# EAGLE design DigPSU (EAGLE 5.07)
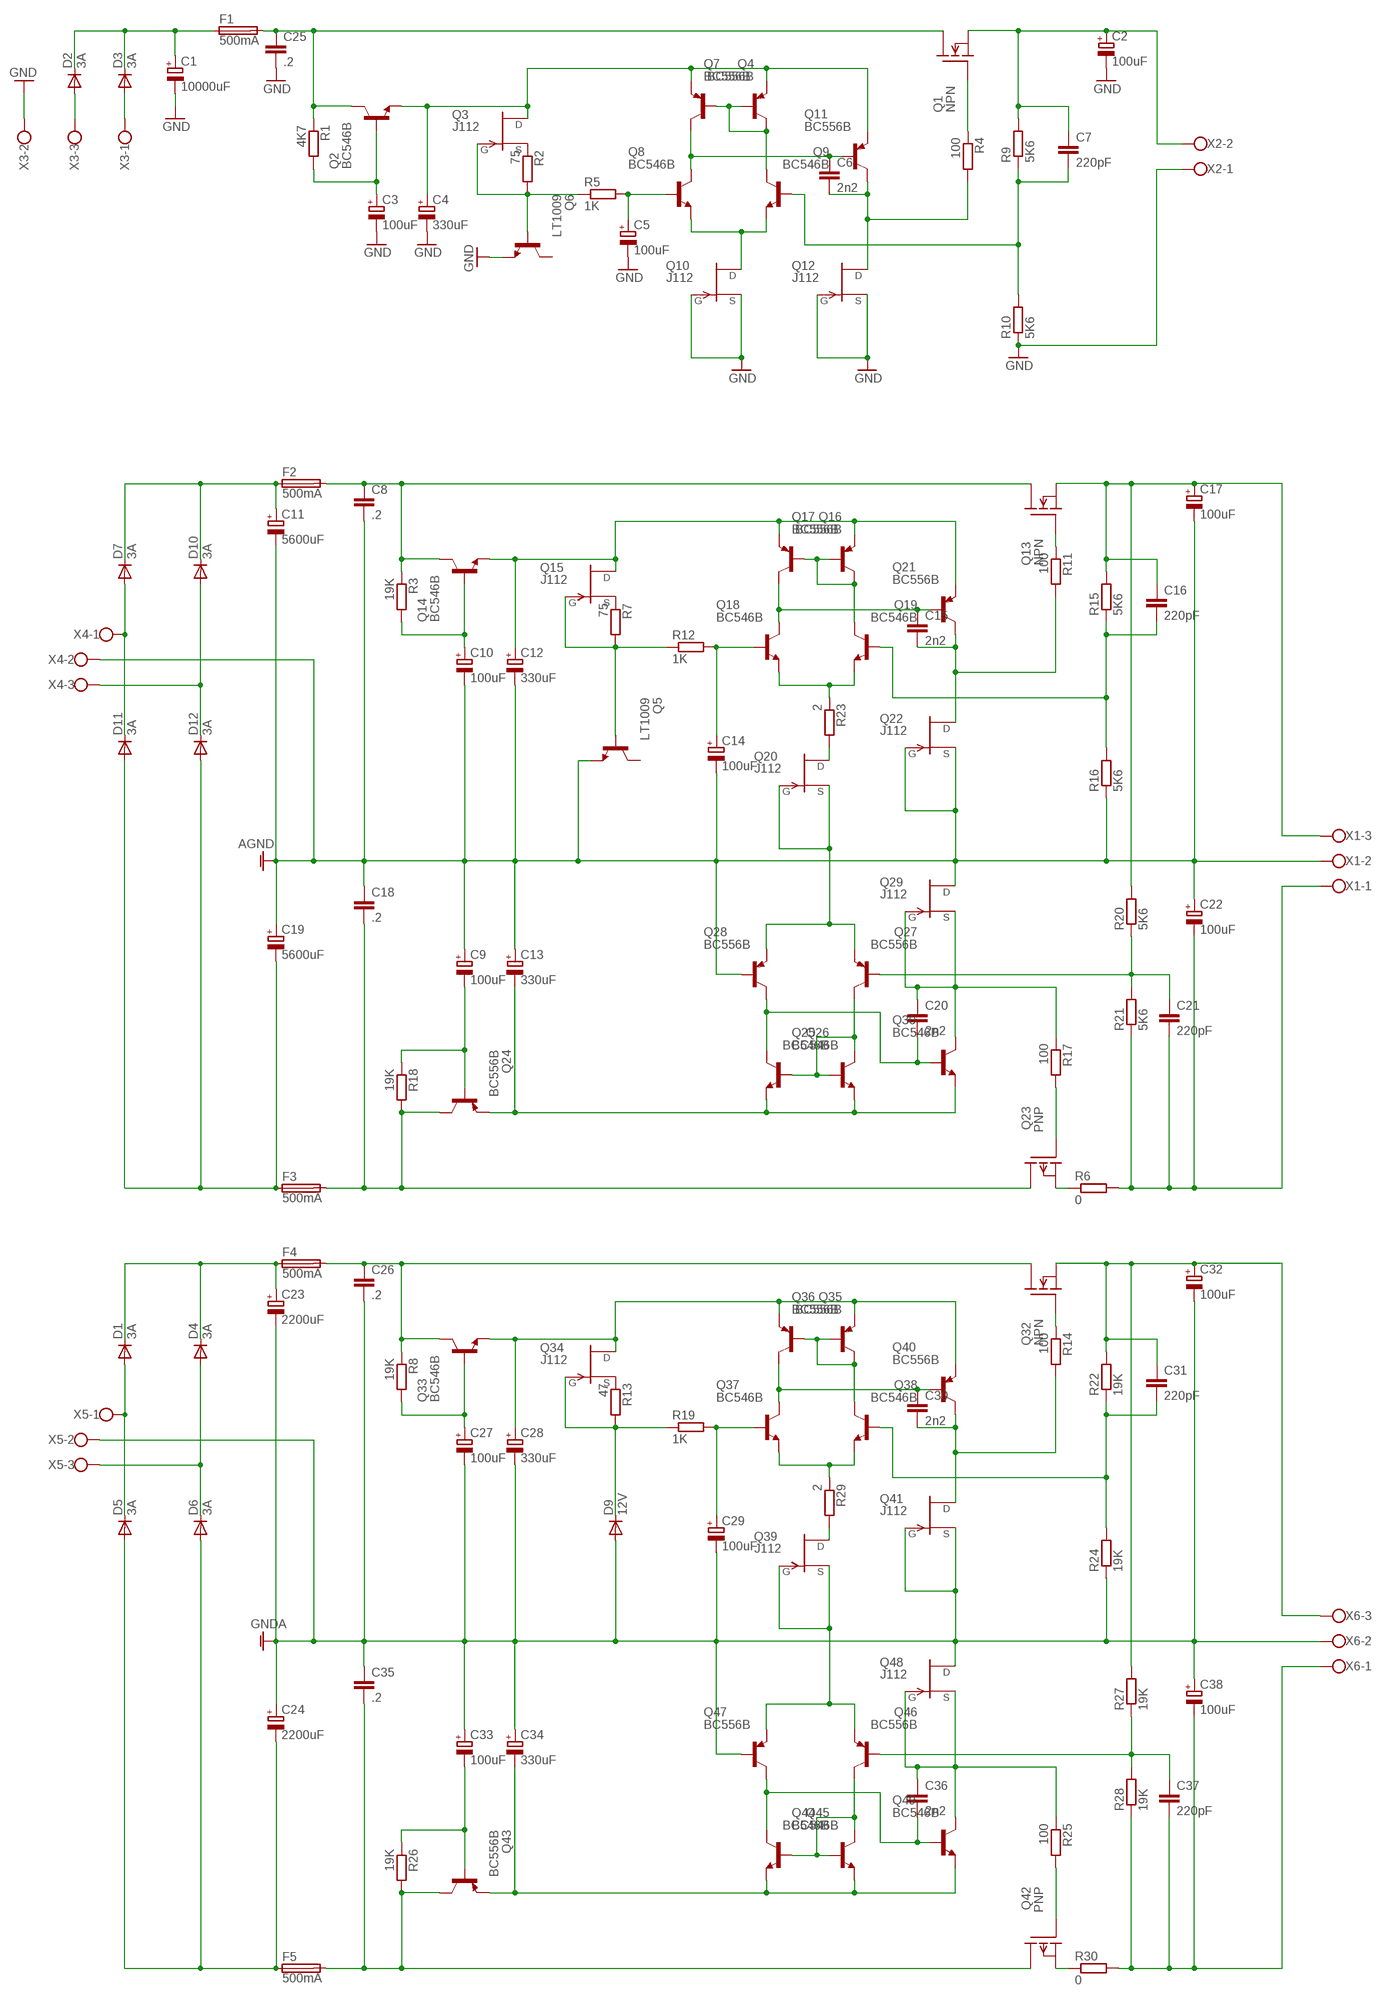
[diagram p0: schematic, sheet 1]

## Parts
C1  10000uF  CPOL-EUE7.5-16  [E7,5-16]
C2  100uF  CPOL-EUE5-10.5  [E5-10,5]
C3  100uF  CPOL-EUE3.5-8  [E3,5-8]
C4  330uF  CPOL-EUE3.5-10  [E3,5-10]
C5  100uF  CPOL-EUE3.5-8  [E3,5-8]
C6  2n2  C-EU050-045X075  [C050-045X075]
C7  220pF  C-EU050-045X075  [C050-045X075]
C8  .2  C-EUC1210K  [C1210K]
C9  100uF  CPOL-EUE3.5-8  [E3,5-8]
C10  100uF  CPOL-EUE3.5-8  [E3,5-8]
C11  5600uF  CPOL-EUE7.5-16  [E7,5-16]
C12  330uF  CPOL-EUE3.5-10  [E3,5-10]
C13  330uF  CPOL-EUE3.5-10  [E3,5-10]
C14  100uF  CPOL-EUE3.5-8  [E3,5-8]
C15  2n2  C-EU050-045X075  [C050-045X075]
C16  220pF  C-EU050-045X075  [C050-045X075]
C17  100uF  CPOL-EUE5-10.5  [E5-10,5]
C18  .2  C-EUC1210K  [C1210K]
C19  5600uF  CPOL-EUE7.5-16  [E7,5-16]
C20  2n2  C-EU050-045X075  [C050-045X075]
C21  220pF  C-EU050-045X075  [C050-045X075]
C22  100uF  CPOL-EUE5-10.5  [E5-10,5]
C23  2200uF  CPOL-EUE7.5-16  [E7,5-16]
C24  2200uF  CPOL-EUE7.5-16  [E7,5-16]
C25  .2  C-EUC1210K  [C1210K]
C26  .2  C-EUC1210K  [C1210K]
C27  100uF  CPOL-EUE3.5-8  [E3,5-8]
C28  330uF  CPOL-EUE3.5-10  [E3,5-10]
C29  100uF  CPOL-EUE3.5-8  [E3,5-8]
C30  2n2  C-EU050-045X075  [C050-045X075]
C31  220pF  C-EU050-045X075  [C050-045X075]
C32  100uF  CPOL-EUE5-10.5  [E5-10,5]
C33  100uF  CPOL-EUE3.5-8  [E3,5-8]
C34  330uF  CPOL-EUE3.5-10  [E3,5-10]
C35  .2  C-EUC1210K  [C1210K]
C36  2n2  C-EU050-045X075  [C050-045X075]
C37  220pF  C-EU050-045X075  [C050-045X075]
C38  100uF  CPOL-EUE5-10.5  [E5-10,5]
D1  3A  A114  [DO204-10]
D2  3A  A114  [DO204-10]
D3  3A  A114  [DO204-10]
D4  3A  A114  [DO204-10]
D5  3A  A114  [DO204-10]
D6  3A  A114  [DO204-10]
D7  3A  A114  [DO204-10]
D9  12V  1N4148DO35-7  [DO35-7]
D10  3A  A114  [DO204-10]
D11  3A  A114  [DO204-10]
D12  3A  A114  [DO204-10]
F1  500mA  19560  [19560]
F2  500mA  19560  [19560]
F3  500mA  19560  [19560]
F4  500mA  19560  [19560]
F5  500mA  19560  [19560]
Q1  NPN  BUZ21  [TO220]
Q2  BC546B  BC550B  [TO92-EBC]
Q3  J112  2N5484  [TO92-]
Q4  BC556B  BC560  [TO92-EBC]
Q5  LT1009  BC546A  [TO92-EBC]
Q6  LT1009  BC546A  [TO92-EBC]
Q7  BC556B  BC560  [TO92-EBC]
Q8  BC546B  BC550B  [TO92-EBC]
Q9  BC546B  BC550B  [TO92-EBC]
Q10  J112  2N5484  [TO92-]
Q11  BC556B  BC560  [TO92-EBC]
Q12  J112  2N5484  [TO92-]
Q13  NPN  BUZ21  [TO220]
Q14  BC546B  BC550B  [TO92-EBC]
Q15  J112  2N5484  [TO92-]
Q16  BC556B  BC560  [TO92-EBC]
Q17  BC556B  BC560  [TO92-EBC]
Q18  BC546B  BC550B  [TO92-EBC]
Q19  BC546B  BC550B  [TO92-EBC]
Q20  J112  2N5484  [TO92-]
Q21  BC556B  BC560  [TO92-EBC]
Q22  J112  2N5484  [TO92-]
Q23  PNP  BUZ171  [TO220]
Q24  BC556B  BC560  [TO92-EBC]
Q25  BC546B  BC550B  [TO92-EBC]
Q26  BC546B  BC550B  [TO92-EBC]
Q27  BC556B  BC560  [TO92-EBC]
Q28  BC556B  BC560  [TO92-EBC]
Q29  J112  2N5484  [TO92-]
Q30  BC546B  BC550B  [TO92-EBC]
Q32  NPN  BUZ21  [TO220]
Q33  BC546B  BC550B  [TO92-EBC]
Q34  J112  2N5484  [TO92-]
Q35  BC556B  BC560  [TO92-EBC]
Q36  BC556B  BC560  [TO92-EBC]
Q37  BC546B  BC550B  [TO92-EBC]
Q38  BC546B  BC550B  [TO92-EBC]
Q39  J112  2N5484  [TO92-]
Q40  BC556B  BC560  [TO92-EBC]
Q41  J112  2N5484  [TO92-]
Q42  PNP  BUZ171  [TO220]
Q43  BC556B  BC560  [TO92-EBC]
Q44  BC546B  BC550B  [TO92-EBC]
Q45  BC546B  BC550B  [TO92-EBC]
Q46  BC556B  BC560  [TO92-EBC]
Q47  BC556B  BC560  [TO92-EBC]
Q48  J112  2N5484  [TO92-]
Q49  BC546B  BC550B  [TO92-EBC]
R1  4K7  R-EU_0204/7  [0204/7]
R2  75  R-EU_0204/7  [0204/7]
R3  19K  R-EU_0204/7  [0204/7]
R4  100  R-EU_0207/10  [0207/10]
R5  1K  R-EU_0204/7  [0204/7]
R6  0  R-EU_0204/7  [0204/7]
R7  75  R-EU_0204/7  [0204/7]
R8  19K  R-EU_0204/7  [0204/7]
R9  5K6  R-EU_0204/7  [0204/7]
R10  5K6  R-EU_0204/7  [0204/7]
R11  100  R-EU_0207/10  [0207/10]
R12  1K  R-EU_0204/7  [0204/7]
R13  47  R-EU_0204/7  [0204/7]
R14  100  R-EU_0207/10  [0207/10]
R15  5K6  R-EU_0204/7  [0204/7]
R16  5K6  R-EU_0204/7  [0204/7]
R17  100  R-EU_0207/10  [0207/10]
R18  19K  R-EU_0204/7  [0204/7]
R19  1K  R-EU_0204/7  [0204/7]
R20  5K6  R-EU_0204/7  [0204/7]
R21  5K6  R-EU_0204/7  [0204/7]
R22  19K  R-EU_0204/7  [0204/7]
R23  2  R-EU_0204/7  [0204/7]
R24  19K  R-EU_0204/7  [0204/7]
R25  100  R-EU_0207/10  [0207/10]
R26  19K  R-EU_0204/7  [0204/7]
R27  19K  R-EU_0204/7  [0204/7]
R28  19K  R-EU_0204/7  [0204/7]
R29  2  R-EU_0204/7  [0204/7]
R30  0  R-EU_0204/7  [0204/7]
X1  W237-3E  [W237-3E]
X2  W237-02P  [W237-132]
X3  W237-3E  [W237-3E]
X4  W237-3E  [W237-3E]
X5  W237-3E  [W237-3E]
X6  W237-3E  [W237-3E]

## Nets
AGND: C8.2 C9.+ C10.- C11.- C12.- C13.+ C14.- C17.- C18.1 C19.+ C22.+ Q5.E Q22.1(G) Q22.2(S) Q28.B Q29.3(D) R16.1 X1.2 X4.2
GND: C1.- C2.- C3.- C4.- C5.- C25.2 Q6.E Q10.1(G) Q10.2(S) Q12.1(G) Q12.2(S) R10.1 X2.1 X3.2
GNDA: C23.- C24.+ C26.2 C27.- C28.- C29.- C32.- C33.+ C34.+ C35.1 C38.+ D9.A Q41.1(G) Q41.2(S) Q47.B Q48.3(D) R24.1 X5.2 X6.2
N$1: C25.1 F1.2 Q1.2(D) Q2.C R1.1
N$2: C2.+ C7.1 Q1.3(S) R9.2 X2.2
N$3: Q1.1(G) R4.1
N$4: C3.+ Q2.B R1.2
N$5: C4.+ Q2.E Q3.3(D) Q4.E Q7.E Q11.E
N$6: Q3.1(G) Q6.B R2.2 R5.1
N$7: D2.A X3.3
N$8: Q3.2(S) R2.1
N$9: C5.+ Q8.B R5.2
N$10: Q4.B Q7.B Q7.C Q9.C
N$11: Q23.1(G) R17.2
N$12: C1.+ D2.C D3.C F1.1
N$13: Q8.E Q9.E Q10.3(D)
N$14: C6.1 Q4.C Q8.C Q11.B
N$15: D3.A X3.1
N$16: Q23.3(S) R6.1
N$17: C8.1 F2.2 Q13.2(D) Q14.C R3.1
N$18: C6.2 Q11.C Q12.3(D) R4.2
N$19: C23.+ D1.C D4.C F4.1
N$20: C24.- D5.A D6.A F5.1
N$21: C7.2 Q9.B R9.1 R10.2
N$22: C10.+ Q14.B R3.2
N$23: D10.A D12.C X4.3
N$24: C12.+ Q14.E Q15.3(D) Q16.E Q17.E Q21.E
N$26: Q5.B Q15.1(G) R7.2 R12.1
N$27: Q15.2(S) R7.1
N$28: Q13.1(G) R11.1
N$29: D7.A D11.C X4.1
N$30: C11.+ D7.C D10.C F2.1
N$31: C14.+ Q18.B R12.2
N$32: Q16.B Q17.B Q17.C Q19.C
N$33: Q18.E Q19.E R23.1
N$34: C35.2 F5.2 Q42.2(D) Q43.C R26.2
N$35: C15.1 Q16.C Q18.C Q21.B
N$36: C15.2 Q21.C Q22.3(D) R11.2
N$37: C26.1 F4.2 Q32.2(D) Q33.C R8.1
N$38: C16.2 Q19.B R15.1 R16.2
N$39: C9.- Q24.B R18.1
N$40: C13.- Q24.E Q25.E Q26.E Q30.E
N$41: Q20.3(D) R23.2
N$43: Q25.B Q25.C Q26.B Q27.C
N$44: C18.2 F3.2 Q23.2(D) Q24.C R18.2
N$45: C21.2 C22.- R6.2 R21.1 X1.1
N$46: C19.- D11.A D12.A F3.1
N$47: C20.2 Q26.C Q28.C Q30.B
N$49: C20.1 Q29.1(G) Q29.2(S) Q30.C R17.1
N$50: D4.A D6.C X5.3
N$51: C21.1 Q27.B R20.1 R21.2
N$52: Q20.1(G) Q20.2(S) Q27.E Q28.E
N$53: C16.1 C17.+ Q13.3(S) R15.2 R20.2 X1.3
N$54: D1.A D5.C X5.1
N$55: C27.+ Q33.B R8.2
N$56: C28.+ Q33.E Q34.3(D) Q35.E Q36.E Q40.E
N$57: D9.C Q34.1(G) R13.2 R19.1
N$58: Q34.2(S) R13.1
N$59: Q32.1(G) R14.1
N$60: C29.+ Q37.B R19.2
N$61: Q35.B Q36.B Q36.C Q38.C
N$62: Q37.E Q38.E R29.1
N$63: C30.1 Q35.C Q37.C Q40.B
N$64: C30.2 Q40.C Q41.3(D) R14.2
N$65: C31.2 Q38.B R22.1 R24.2
N$66: Q42.1(G) R25.2
N$67: C33.- Q43.B R26.1
N$68: C34.- Q43.E Q44.E Q45.E Q49.E
N$69: Q44.B Q44.C Q45.B Q46.C
N$70: C36.2 Q45.C Q47.C Q49.B
N$71: C36.1 Q48.1(G) Q48.2(S) Q49.C R25.1
N$72: C37.2 C38.- R28.1 R30.2 X6.1
N$73: C37.1 Q46.B R27.1 R28.2
N$74: Q39.1(G) Q39.2(S) Q46.E Q47.E
N$75: Q39.3(D) R29.2
N$76: C31.1 C32.+ Q32.3(S) R22.2 R27.2 X6.3
N$77: Q42.3(S) R30.1
Unconnected: Q5.C Q6.C

## Library data of the parts
C1-C5 C9-C14 C17 C19 C22-C24 C27-C29 C32-C34 C38 = resistor:CPOL-EU: POLARIZED CAPACITOR, European symbol
C6-C8 C15 C16 C18 C20 C21 C25 C26 C30 C31 C35-C37 = resistor:C-EU: CAPACITOR, European symbol
D1-D7 D10-D12 = diode:A114: DIODE germanium
D9 = diode:1N4148: DIODE high speed (Philips)
F1-F5 = fuse:19560: FUSE HOLDER TR5, Wickmann
Q1 Q13 Q32 = transistor-fet:BUZ21: N-Channel Enhancement MOSFET 100V; 19A; 0,1Ohm
Q2 Q8 Q9 Q14 Q18 Q19 Q25 Q26 Q30 Q33 Q37 Q38 Q44 Q45 Q49 = transistor-npn:BC550*: NPN Transistor
Q3 Q10 Q12 Q15 Q20 Q22 Q29 Q34 Q39 Q41 Q48 = transistor-fet:?548*: N-Channel JFETs Source: VISHAY 2N5484.pdf Compatible: TO92 2N5245 J304 J305 U310 J308 J309 J310 TO72 2N4416 2N4416A 2N3823 2N4351 3N169 3N170 3N171 MFE3002 TO18 2N3796 2N3797 MFE825 Source: Motorola European Master Guide Pacge 3-59
Q4 Q7 Q11 Q16 Q17 Q21 Q24 Q27 Q28 Q35 Q36 Q40 Q43 Q46 Q47 = transistor-pnp:BC560*: PNP Transistror
Q5 Q6 = transistor-npn:BC546*: NPN Transistor
Q23 Q42 = transistor-fet:BUZ171: P-Channel Enhancement MOSFET -50V; 7A; 0,4Ohm
R1-R30 = resistor:R-EU_: RESISTOR, European symbol
X1 X3-X6 = con-wago-508:W237-3E: WAGO SREW CLAMP
X2 = con-wago-508:W237-02P: WAGO SREW CLAMP

## Board
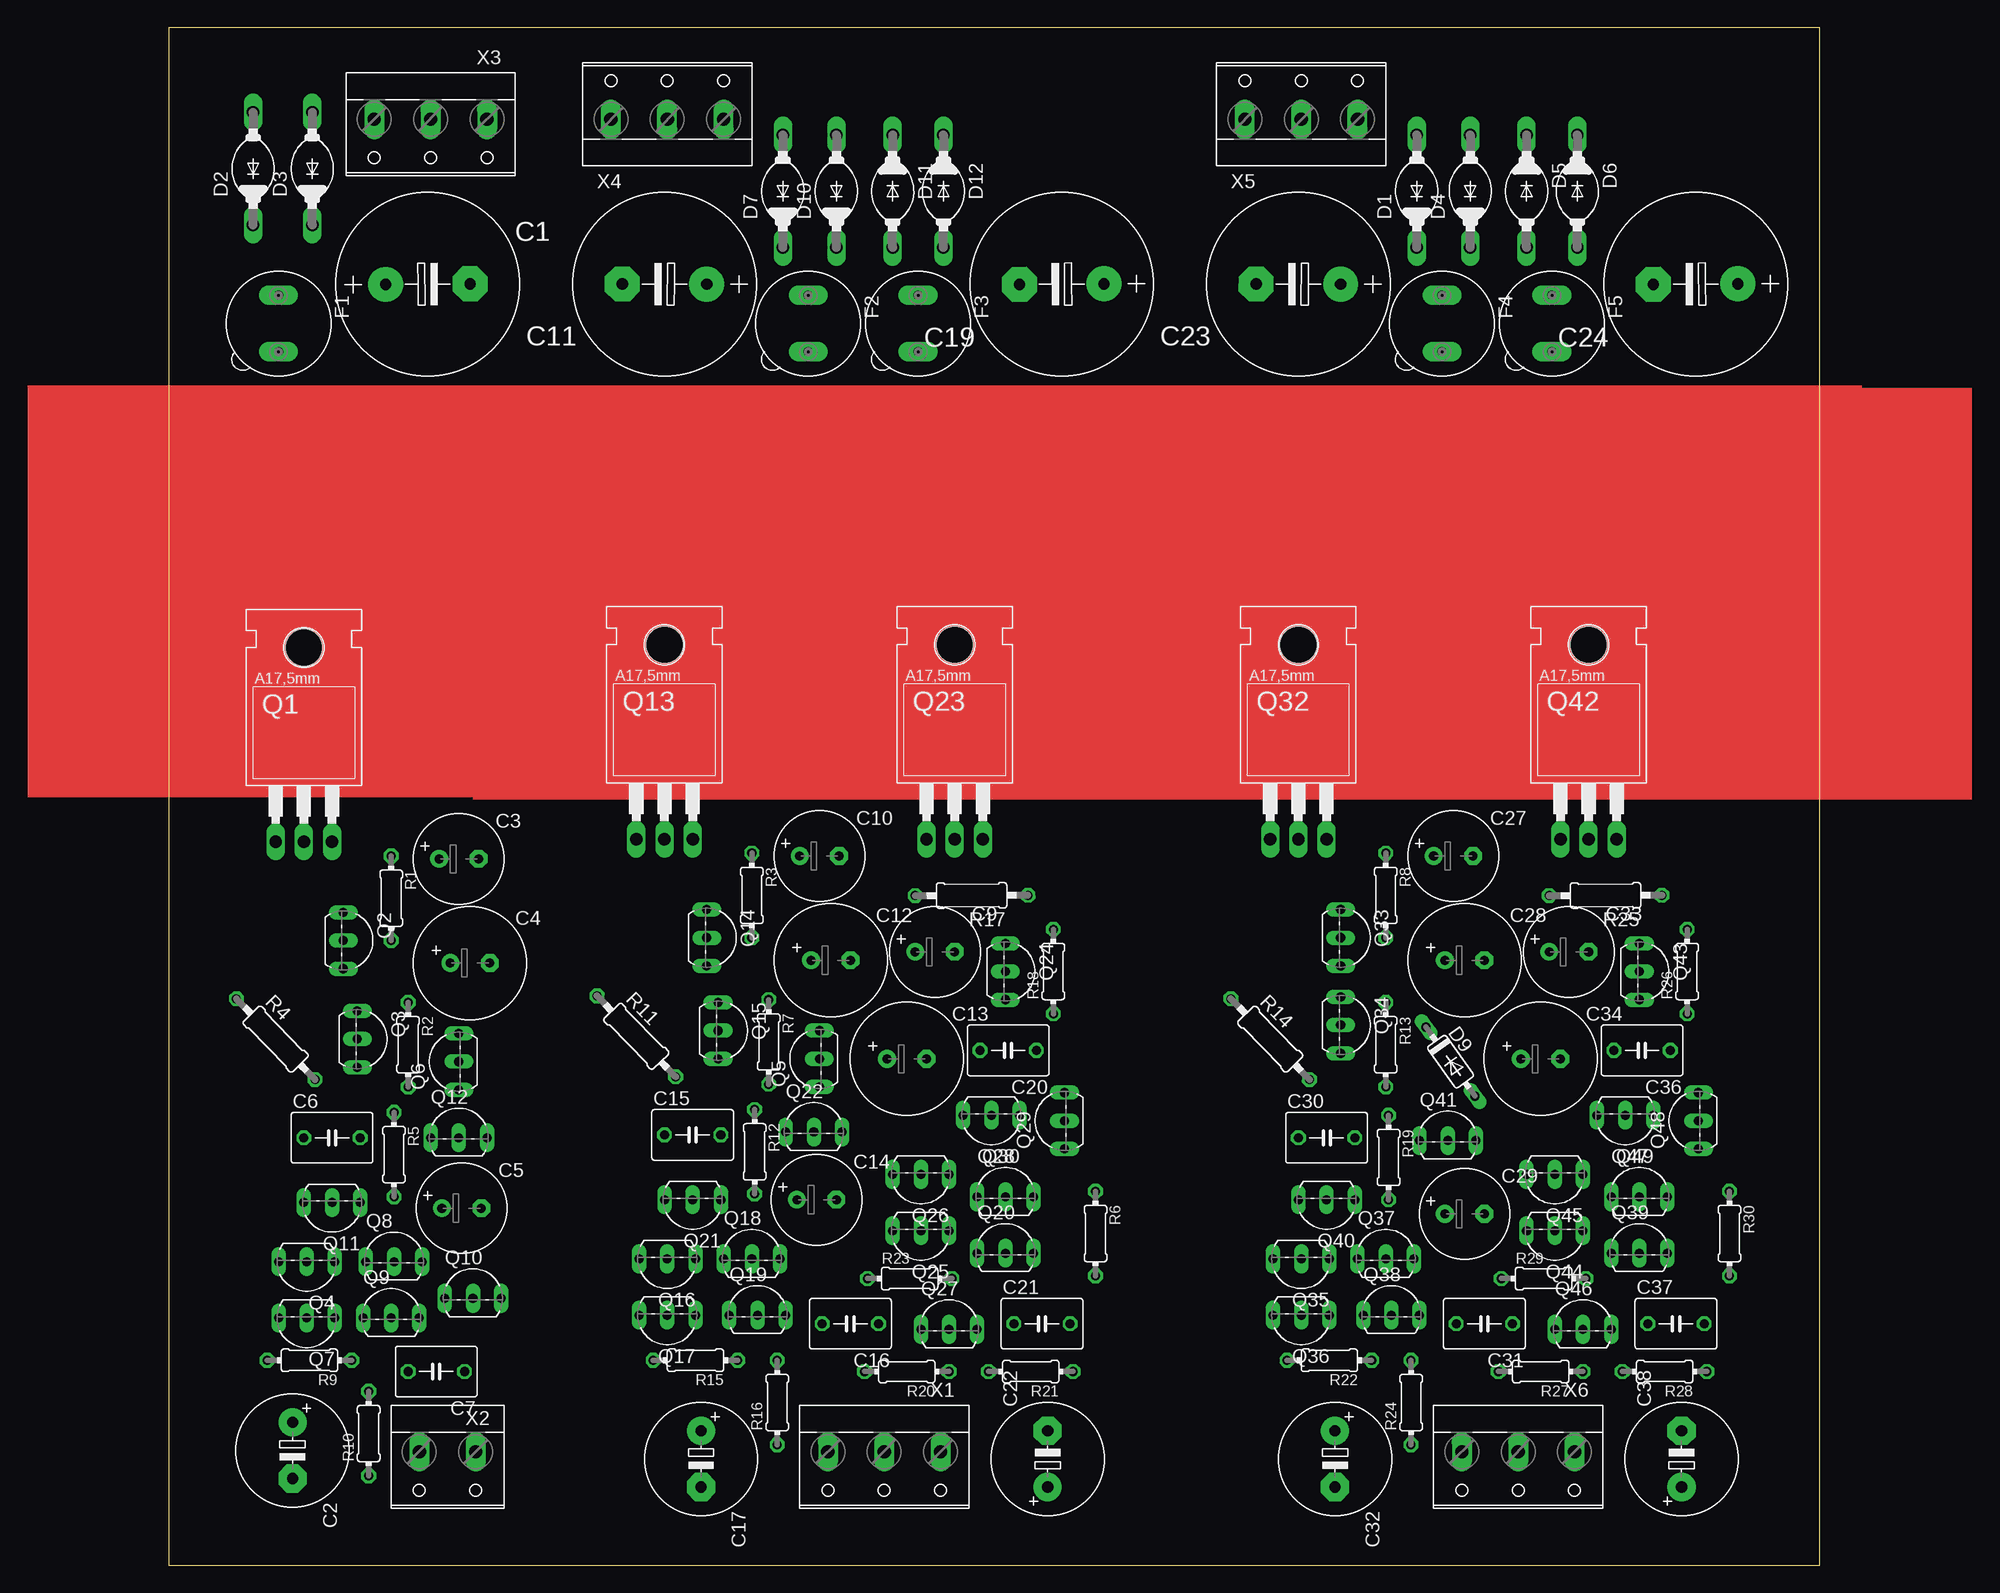
[diagram p1: board, top side]
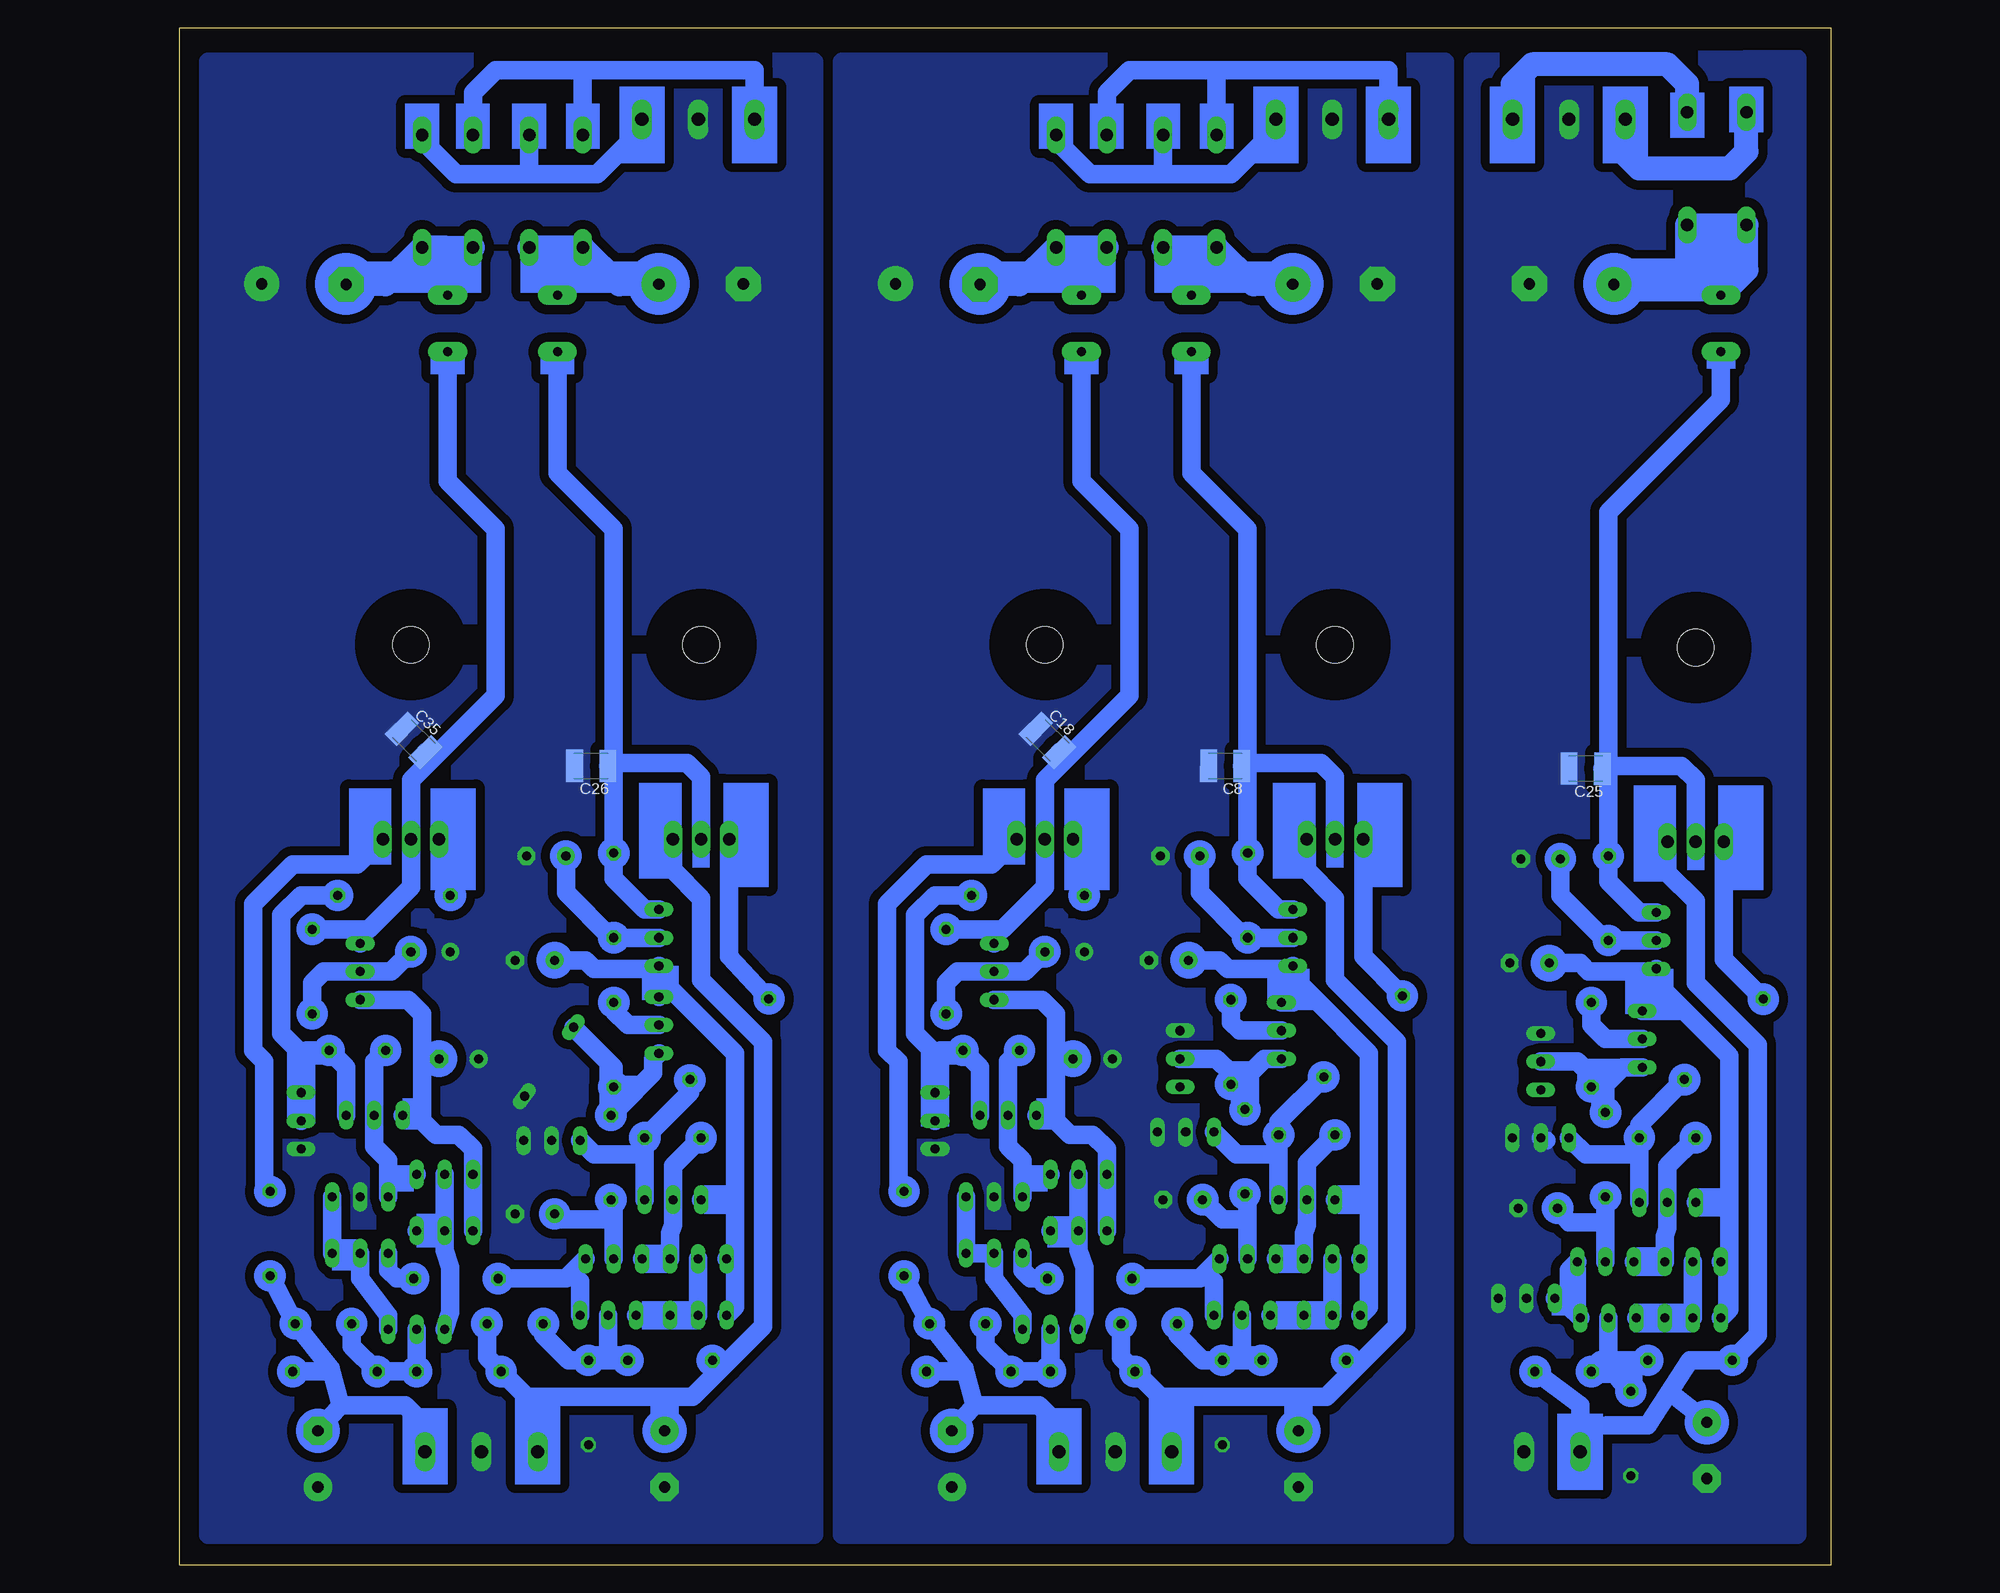
[diagram p2: board, bottom side, seen from below]

Size 148.82 x 138.61 mm. Coordinates in mm from the lower left corner, seen from the top.
Outline: 148.82,138.61 0,138.61 0,0 148.82,0 148.82,138.61
Copper layers (1*16): Top 0.035mm / dielectric 1.5mm / Bottom 0.035mm
Design rules "default *": minimum track width 10mil, minimum drill 24mil, track to track 8mil, track to pad 8mil, pad to pad 8mil, via to via 8mil, smd to smd 8mil, copper to edge 40mil, drill to drill 8mil, minimum pad ring 10mil, minimum via ring 8mil, stop-mask expansion 4mil, vias tented up to drill 0mil, thermal gap 10mil

### Footprints (pad centres in the part's own frame; a part is rotated, then mirrored left to right if it is on the bottom)
E7,5-16 = drill 1.016 pad 3.15 round: + -3.81,0 | drill 1.016 pad 3.15 octagon: - 3.81,0
E5-10,5 = drill 1.016 pad 2.54 round: + -2.54,0 | drill 1.016 pad 2.54 octagon: - 2.54,0
E3,5-8 = drill 0.813 pad 1.6 round: + -1.778,0 | drill 0.813 pad 1.6 octagon: - 1.778,0
E3,5-10 = drill 0.813 pad 1.6 round: + -1.778,0 | drill 0.813 pad 1.6 octagon: - 1.778,0
C050-045X075 = drill 0.813 octagon: 1 -2.54,0; 2 2.54,0
C1210K = smd 1.5 x 2.9: 1 -1.5,0; 2 1.5,0
DO204-10 = drill 1.118 long: A 5.08,0; C -5.08,0
DO35-7 = drill 0.813 long: A 3.81,0; C -3.81,0
19560 = drill 0.813 pad 1.778 long: 1 -2.54,0; 2 2.54,0
TO220 = drill 1.118 long: 1 -2.54,-6.35; 2 0,-6.35; 3 2.54,-6.35 | hole 3.302: 0,11.176
TO92-EBC = drill 0.813 long: B 0,-1.27; C -2.54,-1.27; E 2.54,-1.27
TO92- = drill 0.813 long: 1 2.54,0; 2 0,0; 3 -2.54,0
0204/7 = drill 0.813 octagon: 1 -3.81,0; 2 3.81,0
0207/10 = drill 0.813 octagon: 1 -5.08,0; 2 5.08,0
W237-3E = drill 1.194 long: 1 -5.08,-0.635; 2 0,-0.635; 3 5.08,-0.635
W237-132 = drill 1.194 long: 1 -2.54,-0.635; 2 2.54,-0.635

### Placement (x,y rotation side)
C1  23.35,115.49 0.4 top
C2  11.16,10.34 270 top
C3  26.14,63.68 0 top
C4  27.16,54.28 0 top
C5  26.4,32.18 0 top
C6  14.71,38.53 0 top
C7  24.11,17.45 180 top
C8  54.59,72.06 179.9 bottom
C9  69.07,55.3 0 top
C10  58.65,63.93 0 top
C11  44.68,115.49 179.8 top
C12  59.67,54.53 0 top
C13  66.53,45.64 0 top
C14  58.4,32.94 0 top
C15  47.22,38.79 0 top
C16  61.45,21.77 180 top
C17  47.99,9.58 270 top
C18  70.59,74.35 315 bottom
C19  80.5,115.49 180.4 top
C20  75.67,46.41 180 top
C21  78.72,21.77 0 top
C22  79.23,9.58 90 top
C23  101.83,115.49 179.8 top
C24  137.65,115.49 180.4 top
C25  22.08,71.81 179.9 bottom
C26  111.74,72.06 179.9 bottom
C27  115.8,63.93 0 top
C28  116.82,54.53 0 top
C29  116.82,31.67 0 top
C30  104.37,38.53 0 top
C31  118.6,21.77 180 top
C32  105.14,9.58 270 top
C33  126.22,55.3 0 top
C34  123.68,45.64 0 top
C35  127.74,74.35 315 bottom
C36  132.82,46.41 180 top
C37  135.87,21.77 0 top
C38  136.38,9.58 90 top
D1  112.5,123.88 90 top
D2  7.6,125.91 90 top
D3  12.93,125.91 90 top
D4  117.33,123.88 90 top
D5  122.41,123.88 270 top
D6  126.98,123.88 270 top
D7  55.35,123.88 90 top
D9  115.55,45.39 305.3 top
D10  60.18,123.88 90 top
D11  65.26,123.88 270 top
D12  69.83,123.88 270 top
F1  9.89,111.94 270 top
F2  57.64,111.94 270 top
F3  67.54,111.94 270 top
F4  114.79,111.94 270 top
F5  124.69,111.94 270 top
Q1  12.17,71.55 0 top
Q2  17,56.31 270 top
Q3  17,47.42 270 top
Q4  12.43,26.09 180 top
Q5  57.38,45.64 90 top
Q6  24.87,45.39 90 top
Q7  12.43,21.01 180 top
Q8  20.3,28.63 0 top
Q9  20.05,23.55 0 top
Q10  27.41,24.05 0 top
Q11  14.71,31.42 180 top
Q12  26.14,38.53 0 top
Q13  44.68,71.81 0 top
Q14  49.76,56.57 270 top
Q15  49.51,48.18 270 top
Q16  44.94,26.34 180 top
Q17  44.94,21.26 180 top
Q18  52.56,28.88 0 top
Q19  53.07,23.8 0 top
Q20  75.42,28.12 0 top
Q21  47.22,31.67 180 top
Q22  58.15,39.04 0 top
Q23  70.85,71.81 0 top
Q24  76.69,53.52 270 top
Q25  67.8,28.88 180 top
Q26  67.8,33.96 180 top
Q27  70.34,22.53 0 top
Q28  75.42,34.47 0 top
Q29  80.75,40.06 90 top
Q30  74.15,39.29 180 top
Q32  101.83,71.81 0 top
Q33  106.91,56.57 270 top
Q34  105.64,48.69 270 top
Q35  102.09,26.34 180 top
Q36  102.09,21.26 180 top
Q37  109.71,28.88 0 top
Q38  110.22,23.8 0 top
Q39  132.57,28.12 0 top
Q40  104.37,31.67 180 top
Q41  115.3,38.28 0 top
Q42  128,71.81 0 top
Q43  133.84,53.52 270 top
Q44  124.95,28.88 180 top
Q45  124.95,33.96 180 top
Q46  127.49,22.53 0 top
Q47  132.57,34.47 0 top
Q48  137.9,40.06 90 top
Q49  131.3,39.29 180 top
R1  20.05,60.12 270 top
R2  21.57,46.91 270 top
R3  52.56,60.38 270 top
R4  9.63,47.42 314.2 top
R5  20.3,37.01 270 top
R6  83.55,29.9 270 top
R7  54.08,47.17 270 top
R8  109.71,60.38 270 top
R9  12.68,18.47 180 top
R10  18.01,11.86 90 top
R11  42.14,47.68 314.2 top
R12  52.81,37.26 270 top
R13  109.71,46.91 270 top
R14  99.29,47.42 314.2 top
R15  47.48,18.47 180 top
R16  54.84,14.66 90 top
R17  72.37,60.38 180.2 top
R18  79.74,53.52 90 top
R19  109.96,36.75 270 top
R20  66.53,17.45 180 top
R21  77.7,17.45 180 top
R22  104.63,18.47 180 top
R23  66.78,25.83 0 top
R24  111.99,14.66 90 top
R25  129.52,60.38 180.2 top
R26  136.89,53.52 90 top
R27  123.68,17.45 180 top
R28  134.85,17.45 180 top
R29  123.93,25.83 0 top
R30  140.7,29.9 270 top
X1  64.5,9.58 180 top
X2  25.13,9.58 180 top
X3  23.6,129.72 180 top
X4  44.94,130.99 0 top
X5  102.09,130.99 0 top
X6  121.65,9.58 180 top

### Tracks (layer width: path | path; a pad name or v marks a point on that pad's centre or on a via)
AGND
  pour Bottom (isolate 0.813, no thermals): 34.78,135.56 34.78,2.72 89.13,2.72 89.13,135.56
GND
  Bottom 1.676: 25.63,38.28 Q12.2
  pour Bottom (isolate 0.813, no thermals): 3.03,135.81 3.03,2.72 32.24,2.72 32.24,135.56
GNDA
  pour Bottom (isolate 0.813, no thermals): 91.67,135.56 91.67,2.72 146.28,2.72 146.28,135.56
N$1
  Bottom 1.676: Q2.C 17.25,58.85 20.05,61.65 R1.1 20.05,71.81 | Q1.2 12.17,70.79 13.44,72.06 20.05,72.06 | 20.05,71.81 20.05,72.06 | C25.1 20.05,71.81 | 20.05,72.06 20.05,94.92 9.89,105.08 F1.2
N$2
  Bottom 1.676: Q1.3 14.71,62.41 12.17,59.87 12.17,52.5 6.58,46.91 6.58,20.75 R9.2 12.68,18.47 14.68,15.4 | X2.2 22.02,10.78 22.21,12.58 | 14.68,15.4 16.03,13.33 16.49,12.62 20.17,12.62 22.21,12.58 | C2.+ 11.61,13.33 14.53,15.63 14.68,15.4 | 22.21,12.58 22.21,10.71 22.59,10.34 22.59,14.4 C7.1
N$3
  Bottom 1.676: R4.1 9.63,54.6 Q1.1
N$4
  Bottom 1.676: Q2.B R1.2 20.3,56.31 24.36,60.38 C3.+
N$5
  Bottom 1.676: Q7.E 9.12,23.04 9.12,27.36 | 9.12,27.36 Q4.E | 9.12,27.36 9.12,32.69 | 9.12,32.69 Q11.E | 9.12,32.69 9.12,45.9 13.19,49.96 | C4.+ 22.59,54.28 21.82,53.52 16.74,53.52 | 13.19,49.96 16.74,53.52 | Q2.E 15.98,53.52 16.74,53.52 | 13.19,49.96 Q3.3
N$6
  Bottom 1.676: Q6.B 22.84,45.39 21.57,44.12 R2.2 20.3,43.1 | Q3.1 18.78,44.88 20.3,43.36 20.3,43.1 | R5.1 20.3,43.1
N$7
  Bottom 2.184: D2.A 7.6,127.43 9.12,125.91 17.25,125.91 18.52,127.18 X3.3
N$8
  Bottom 1.676: R2.1 21.57,48.69 20.3,47.42 Q3.2
N$9
  Bottom 1.676: Q8.B 20.3,30.91 | 20.3,30.91 R5.2 | C5.+ 23.6,30.91 20.3,30.91
N$10
  Bottom 1.676: Q4.B Q7.B Q7.C Q9.C
N$11
  Bottom 1.676: Q23.1 67.29,64.44 R17.2
N$12
  Bottom 1.676: F1.1 9.89,115.49
  Bottom 2.184: C1.+ 19.51,115.49 12.93,115.49 | 12.93,115.49 9.89,115.49 8.87,115.49 7.6,116.76 D2.C | 12.93,115.49 D3.C
N$13
  Bottom 1.676: Q9.E 23.6,23.29 23.6,24.05 | 23.6,24.05 23.6,26.59 Q8.E | 23.6,24.05 Q10.3
N$14
  Bottom 1.676: Q8.C Q4.C 14.97,29.64 14.71,30.4 Q11.B 14.71,35.99 C6.1
N$15
  Bottom 2.184: D3.A 12.93,133.53 14.71,135.31 26.9,135.31 28.68,133.53 X3.1
N$16
  Bottom 1.676: Q23.3 75.67,63.17 81.51,63.17 85.07,59.61 85.07,46.41 84.05,45.39 84.05,34.47 83.55,33.96 R6.1
N$17
  Bottom 1.676: Q14.C 49.76,59.11 52.56,61.9 R3.1 52.56,72.06 | Q13.2 44.68,71.04 45.95,72.31 52.56,72.31 | 52.56,72.06 52.56,72.31 | C8.1 52.56,72.06 | 52.56,72.31 52.56,93.4 57.64,98.48 F2.2
N$18
  Bottom 1.676: Q11.C 17.25,37.01 | 17.25,37.01 C6.2 17.25,39.7 R4.2 | Q12.3 22.08,37.01 17.25,37.01
N$19
  Bottom 1.676: 114.79,118.8 F4.1
  Bottom 2.184: C23.+ 109.19,115.48 D1.C 114.79,118.8 D4.C
N$20
  Bottom 1.676: F5.1 124.69,118.54 124.95,118.8
  Bottom 2.184: C24.- 130.31,115.47 D6.A 124.95,118.8 D5.A
N$21
  Bottom 1.676: 20.05,18.47 Q9.B | 19.03,18.47 R9.1 | 19.03,18.47 20.05,18.47 | C7.2 21.57,17.7 20.81,18.47 20.05,18.47 | R10.2 19.03,16.69 19.03,18.47
N$22
  Bottom 1.676: Q14.B R3.2 52.81,56.57 56.88,60.63 C10.+
N$23
  Bottom 1.676: X4.3 50.65,128.83 54.08,125.4 60.18,125.4 | 60.18,125.4 D10.A | D12.C 69.83,128.45 66.78,125.4 60.18,125.4
N$24
  Bottom 1.676: Q17.E 41.64,23.29 41.64,27.61 | 41.64,27.61 Q16.E | 41.64,27.61 41.64,32.94 | 41.64,32.94 Q21.E | 41.64,32.94 41.64,46.15 46.34,50.85 | C12.+ 55.1,54.53 54.34,53.77 49.26,53.77 | 46.34,50.85 49.26,53.77 | Q14.E 48.49,53.77 49.26,53.77 | Q15.3 48.49,50.72 48.49,50.85 46.34,50.85
N$26
  Bottom 1.676: Q5.B 55.35,45.64 54.08,44.37 R7.2 52.81,43.36 | Q15.1 51.03,45.64 52.81,43.87 52.81,43.36 | R12.1 52.81,43.36
N$27
  Bottom 1.676: R7.1 54.08,48.95 53.32,48.18 Q15.2
N$28
  Bottom 1.676: R11.1 42.14,54.86 Q13.1
N$29
  Bottom 1.676: X4.1 39.86,134.8 55.35,134.8 | 55.35,134.8 D7.A | D11.C 65.26,132.77 63.23,134.8 55.35,134.8
N$30
  Bottom 1.676: 57.64,118.8 F2.1
  Bottom 2.184: C11.+ 52.04,115.48 D7.C 57.64,118.8 D10.C
N$31
  Bottom 1.676: Q18.B 52.56,30.66 52.56,31.17 | C14.+ 54.84,31.17 52.56,31.17 | R12.2 52.56,33.2 52.56,31.17
N$32
  Bottom 1.676: Q16.B Q17.B Q17.C Q19.C
N$33
  Bottom 1.676: 55.99,26.72 Q18.E | 55.99,26.72 56.88,25.83 R23.1 | Q19.E 55.61,25.58 55.99,25.96 55.99,26.72
N$34
  Bottom 1.676: 132.57,57.33 131.81,57.33 128,61.14 Q42.2 128,70.79 126.09,72.69 | 132.57,57.33 R26.2 | 132.57,57.33 Q43.C | F5.2 124.69,97.71 120.38,93.4 120.38,78.41 126.09,72.69 | C35.2 | 126.09,72.69 C35.2
N$35
  Bottom 1.676: Q18.C Q16.C 47.48,29.9 47.22,30.66 Q21.B 47.22,36.25 C15.1
N$36
  Bottom 1.676: Q21.C 49.76,37.01 | 49.76,37.01 C15.2 49.76,39.96 R11.2 | Q22.3 53.57,37.01 49.76,37.01
N$37
  Bottom 1.676: Q33.C 106.91,59.11 109.71,61.9 R8.1 109.71,72.06 | Q32.2 101.83,71.04 103.1,72.31 109.71,72.31 | 109.71,72.06 109.71,72.31 | C26.1 109.71,72.06 | 109.71,72.31 109.71,93.4 114.79,98.48 F4.2
N$38
  Bottom 1.676: R15.1 53.07,18.47 | 53.07,18.47 R16.2 56.62,18.47 58.91,20.75 C16.2 | 53.07,18.47 Q19.B
N$39
  Bottom 1.676: C9.- 72.62,53.52 Q24.B 78.72,53.52 79.74,52.5 R18.1
N$40
  Bottom 1.676: Q24.E 71.1,50.98 69.83,49.71 69.83,45.64 | 69.83,45.64 C13.- | 69.83,40.56 69.83,40.06 68.56,38.79 66.53,38.79 65.26,37.52 Q26.E Q25.E | 69.83,40.56 69.83,45.64 | 69.83,40.56 Q30.E
N$41
  Bottom 1.676: R23.2 72.12,25.83 72.88,26.59 Q20.3
N$43
  Bottom 1.676: Q25.B Q26.B | Q25.B 68.05,30.15 | 68.05,30.15 Q25.C | 68.05,30.15 67.8,29.9 | Q27.C 67.29,22.78 67.29,26.85 67.8,28.37 Q25.B
N$44
  Bottom 1.676: 75.42,57.33 74.66,57.33 70.85,61.14 Q23.2 70.85,70.79 68.94,72.69 | 75.42,57.33 R18.2 | Q24.C 75.42,57.33 | F3.2 67.54,97.71 63.23,93.4 63.23,78.41 68.94,72.69 | C18.2 | 68.94,72.69 C18.2
N$45
  Bottom 1.676: C21.2 81.51,22.02 | C21.2 R6.2 | X1.1 69.58,12.62 71.35,14.4 77.2,14.4 | 77.2,14.4 78.08,17.76 | 78.08,17.76 C21.2 | R21.1 78.72,17.45 78.41,17.76 78.08,17.76 | 77.2,14.4 C22.-
N$46
  Bottom 1.676: F3.1 67.54,118.54 67.8,118.8
  Bottom 2.184: C19.- 73.16,115.47 D12.A 67.8,118.8 D11.A
N$47
  Bottom 1.676: C20.2 74.15,45.39 Q30.B 74.15,37.77 72.88,36.5 72.88,35.23 | 72.88,35.23 Q28.C | Q26.C 72.88,35.23
N$49
  Bottom 1.676: R17.1 77.47,60.38 80.75,60.38 82.53,58.6 82.53,47.93 80.75,46.15 | Q29.2 Q29.1 80.75,46.15 | Q30.C 76.69,44.88 C20.1 80.24,46.41 80.5,46.15 80.75,46.15
N$50
  Bottom 1.676: X5.3 107.8,128.83 111.23,125.4 117.33,125.4 | 117.33,125.4 D4.A | D6.C 126.98,128.45 123.93,125.4 117.33,125.4
N$51
  Bottom 1.676: Q27.B R20.1 R21.2 76.18,19.74 C21.1
N$52
  Bottom 1.676: Q28.E Q20.1 Q20.2 75.42,25.83 72.88,22.53 Q27.E
N$53
  Bottom 1.676: Q13.3 47.22,62.66 44.68,60.12 44.68,52.76 39.1,47.17 39.1,21.51 42.52,18.09 | C16.1 63.99,18.72 R20.2 60.43,15.16 59.42,15.16 | 47.99,15.16 59.42,15.16 | C17.+ 47.99,15.16 | 59.42,15.16 X1.3 | 42.52,18.09 45.45,15.16 47.99,15.16 | 42.52,18.09 R15.2
N$54
  Bottom 1.676: X5.1 97.01,134.8 112.5,134.8 | 112.5,134.8 D1.A | D5.C 122.41,132.77 120.38,134.8 112.5,134.8
N$55
  Bottom 1.676: Q33.B R8.2 109.96,56.57 114.03,60.63 C27.+
N$56
  Bottom 1.676: Q36.E 98.79,23.29 98.79,27.61 | 98.79,27.61 Q35.E | 98.79,27.61 98.79,32.94 | 98.79,32.94 Q40.E | 98.79,32.94 98.79,46.15 105.39,52.76 | C28.+ 112.25,54.53 111.49,53.77 105.64,53.77 Q33.E 105.39,52.76 | 105.39,52.76 Q34.3
N$57
  Bottom 1.676: D9.C 109.71,44.86 R13.2 109.71,41.33 | 109.71,41.33 109.71,41.07 109.96,40.82 R19.1 | Q34.1 106.15,45.64 106.15,44.37 109.2,41.33 109.71,41.33
N$58
  Bottom 1.676: Q34.2 108.44,48.69 109.71,49.96 R13.1
N$59
  Bottom 1.676: R14.1 99.29,54.86 Q32.1
N$60
  Bottom 1.676: Q37.B 109.71,31.17 | C29.+ 114.28,31.17 109.71,31.17 | R19.2 109.71,33.2 109.71,31.17
N$61
  Bottom 1.676: Q35.B Q36.B Q36.C Q38.C
N$62
  Bottom 1.676: 113.14,26.72 Q37.E | 113.14,26.72 114.03,25.83 R29.1 | Q38.E 112.76,25.58 113.14,25.96 113.14,26.72
N$63
  Bottom 1.676: Q37.C Q35.C 104.63,29.9 104.37,30.66 Q40.B 104.37,35.99 C30.1
N$64
  Bottom 1.676: Q40.C 106.91,37.01 | 106.91,37.01 C30.2 102.85,42.6 R14.2 | Q41.3 111.49,37.01 106.91,37.01
N$65
  Bottom 1.676: R22.1 110.22,18.47 | 110.22,18.47 R24.2 113.77,18.47 116.06,20.75 C31.2 | 110.22,18.47 Q38.B
N$66
  Bottom 1.676: Q42.1 124.44,64.44 R25.2
N$67
  Bottom 1.676: C33.- 129.77,53.52 Q43.B 135.87,53.52 136.89,52.5 R26.1
N$68
  Bottom 1.676: Q43.E 128.25,50.98 126.98,49.71 126.98,45.64 | 126.98,45.64 C34.- | 126.98,40.56 126.98,40.06 125.71,38.79 123.68,38.79 122.41,37.52 Q45.E Q44.E | 126.98,40.56 126.98,45.64 | 126.98,40.56 Q49.E
N$69
  Bottom 1.676: Q44.B Q45.B | Q44.B 125.2,30.15 | 125.2,30.15 Q44.C | 125.2,30.15 124.95,29.9 | Q46.C 124.44,22.78 124.44,26.85 124.95,28.37 Q44.B
N$70
  Bottom 1.676: C36.2 131.3,45.39 Q49.B 131.3,37.77 130.03,36.5 130.03,35.23 | 130.03,35.23 Q47.C | Q45.C 130.03,35.23
N$71
  Bottom 1.676: R25.1 134.62,60.38 137.9,60.38 139.68,58.6 139.68,47.93 137.9,46.15 | Q48.2 Q48.1 137.9,46.15 | Q49.C 133.84,44.88 C36.1 137.39,46.41 137.65,46.15 137.9,46.15
N$72
  Bottom 1.676: C37.2 138.66,22.02 | C37.2 R30.2 | X6.1 126.73,12.62 128.5,14.4 134.35,14.4 | 134.35,14.4 135.23,17.76 | 135.23,17.76 C37.2 | R28.1 135.87,17.45 135.56,17.76 135.23,17.76 | 134.35,14.4 C38.-
N$73
  Bottom 1.676: Q46.B R27.1 R28.2 133.33,19.74 C37.1
N$74
  Bottom 1.676: Q47.E Q39.1 Q39.2 132.57,25.83 130.03,22.53 Q46.E
N$75
  Bottom 1.676: R29.2 129.27,25.83 130.03,26.59 Q39.3
N$76
  Bottom 1.676: Q32.3 104.37,62.66 101.83,60.12 101.83,52.76 96.25,47.17 96.25,21.51 99.67,18.09 | C31.1 121.14,18.72 R27.2 117.58,15.16 116.57,15.16 | 105.14,15.16 116.57,15.16 | C32.+ 105.14,15.16 | 116.57,15.16 X6.3 | 99.67,18.09 102.6,15.16 105.14,15.16 | 99.67,18.09 R22.2
N$77
  Bottom 1.676: Q42.3 132.82,63.17 138.66,63.17 142.22,59.61 142.22,46.41 141.2,45.39 141.2,34.47 140.7,33.96 R30.1
(copper drawn outside any net)
  shapes: Bottom area x127, Bottom circle x108, Top area x4